# EAGLE design Grove - BLE v1.0 (EAGLE 6.4)

## Sheet 1 of 2
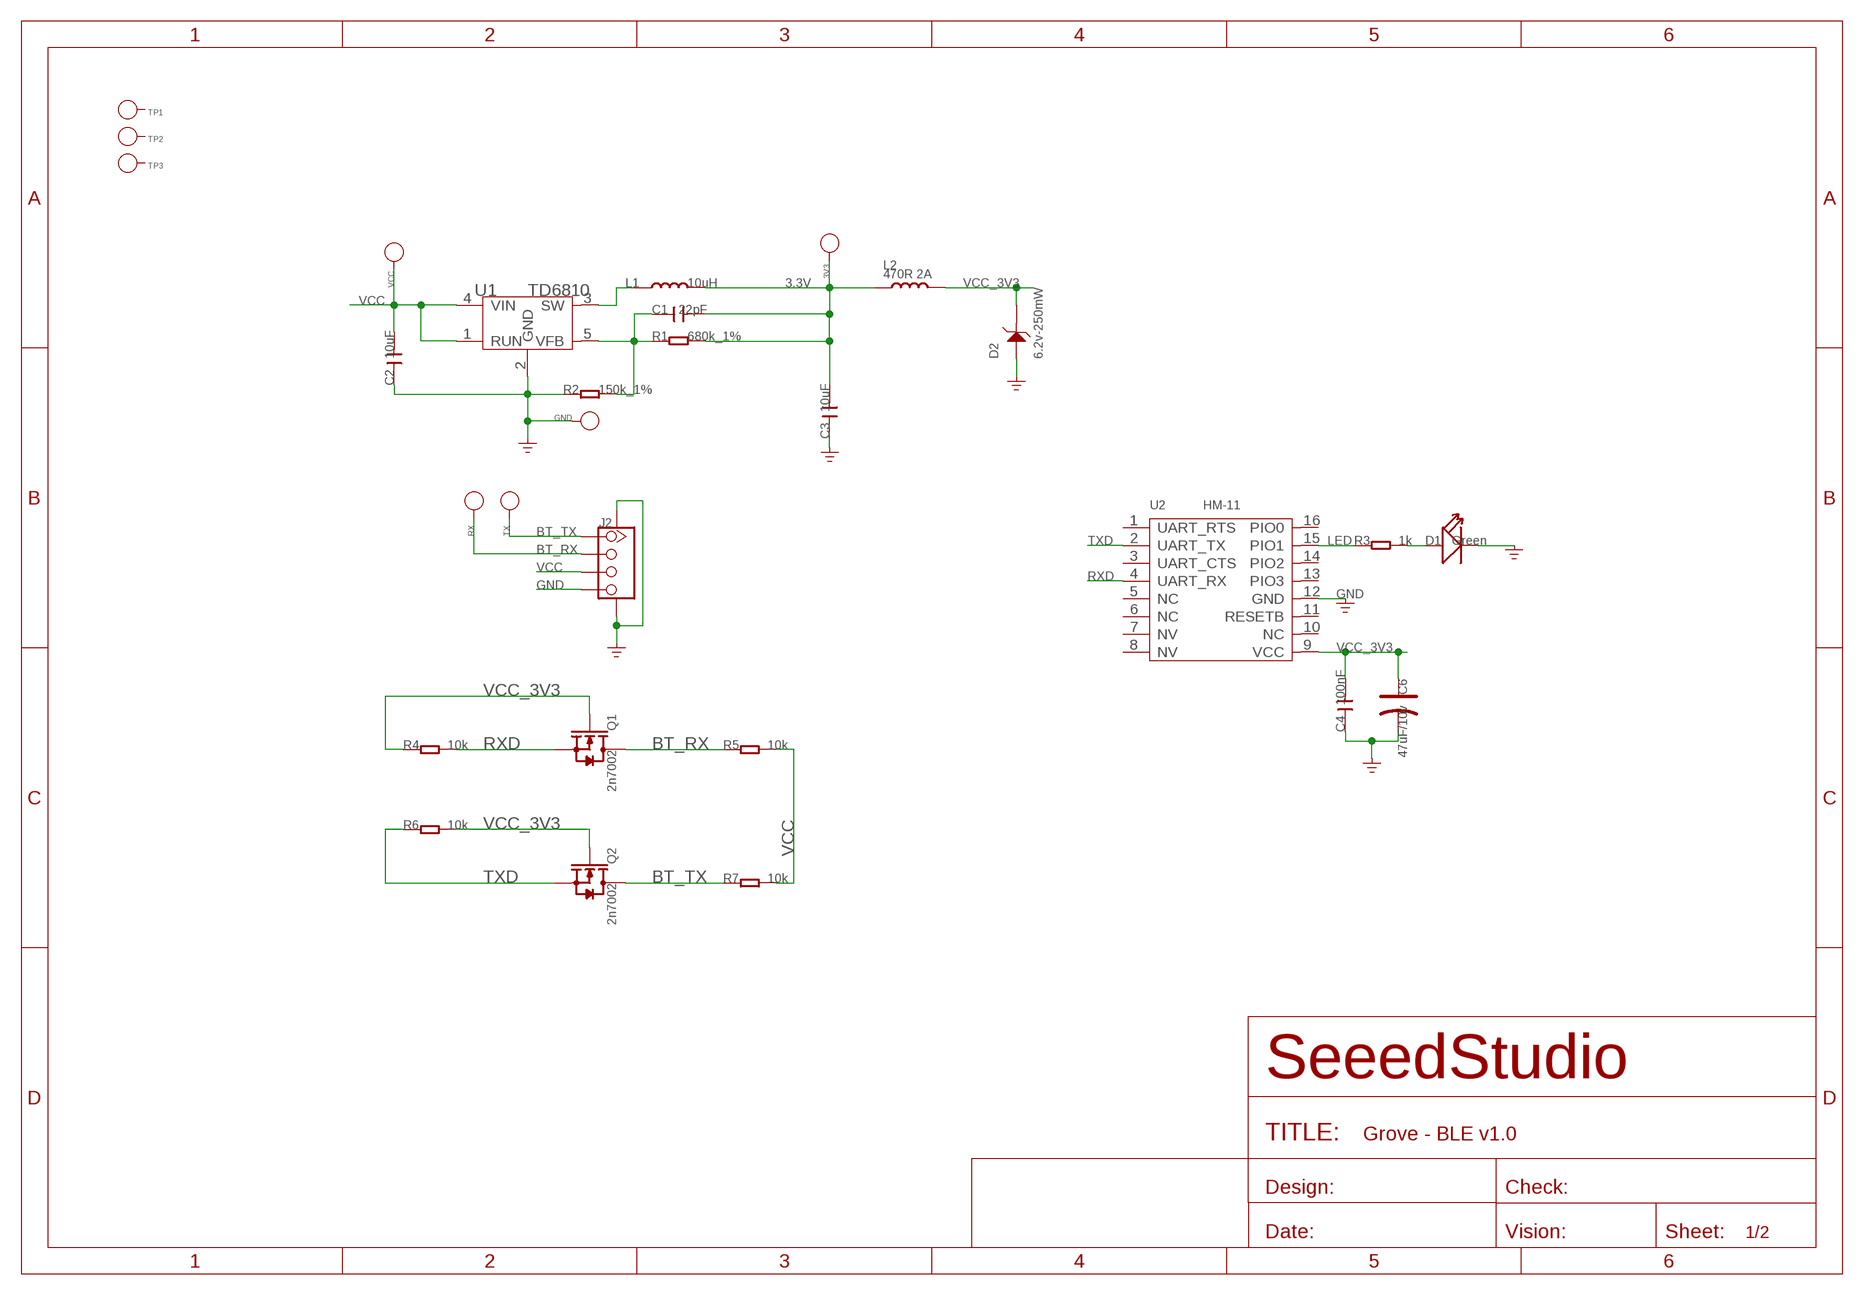
[diagram p0: schematic, sheet 1]

### Parts
3V3  PAD-TEST-POINT'4545'  [TP_4545]
C1  22pF  C-0603  [C0603]
C2  10uF  C-0805  [C0805]
C3  10uF  C-0805  [C0805]
C4  100nF  C-0603  [C0603]
C6  47uF/10v  CAP-AVX-B  [AVX-B]
D1  Green  LED'0603'  [LED-0603]
D2  6.2v-250mW  D-ESD-2P'CESD5V0D1'  [SOD123-2.7X1.6]
GND  PAD-TEST-POINT'4545'  [TP_4545]
J2  TWIG-4P-2.0-SMD-FEMALE-REINFORCE'DD'  [4P-SMD-2.0]
L1  10uH  L'1813'  [1813]
L2  470R 2A  L'0805'  [L0805]
Q1  2n7002  MOSFET-N'SOT23'  [SOT23]
Q2  2n7002  MOSFET-N'SOT23'  [SOT23]
R1  680k_1%  005-R0603  [0603@1]
R2  150k_1%  005-R0603  [0603@1]
R3  1k  R-0603  [R0603]
R4  10k  R-0603  [R0603]
R5  10k  R-0603  [R0603]
R6  10k  R-0603  [R0603]
R7  10k  R-0603  [R0603]
RX  PAD-TEST-POINT'4545'  [TP_4545]
TP1  PAD-TEST-POINT'4545'  [TP_4545]
TP2  PAD-TEST-POINT'4545'  [TP_4545]
TP3  PAD-TEST-POINT'4545'  [TP_4545]
TX  PAD-TEST-POINT'4545'  [TP_4545]
U1  TD6810  TD6810'TSOT23-5'  [SOT23-5]
U2  HM-11  [16P-18.5X13.5X0.8]
VCC  PAD-TEST-POINT'4545'  [TP_4545]

### Nets
3.3V: 3V3.T C1.2 C3.2 L1.2 L2.1 R1.2
BT_RX: J2.2 Q1.3(D) R5.1 RX.T
BT_TX: J2.1 Q2.3(D) R7.1 TX.T
GND: C2.1 C3.1 C4.1 C6.- D1.- D2.1 GND.T J2.4 J2.SS1 J2.SS2 R2.1 U1.2(GND) U2.12(GND)
LED: R3.1 U2.15(PIO1)
N$7: D1.+ R3.2
N$13: C1.1 R1.1 R2.2 U1.5(VFB)
N$18: L1.1 U1.3(SW)
RXD: Q1.2(S) R4.2 U2.4(UART_RX)
TXD: Q2.2(S) R6.1 U2.2(UART_TX)
VCC: C2.2 J2.3 R5.2 R7.2 U1.1(RUN) U1.4(VIN) VCC.T
VCC_3V3: C4.2 C6.+ D2.2 L2.2 Q1.1(G) Q2.1(G) R4.1 R6.2 U2.9(VCC)
Unconnected: TP1.T TP2.T TP3.T U2.1(UART_RTS) U2.3(UART_CTS) U2.5(NC) U2.6(NC) U2.7(NV) U2.8(NV) U2.10(NC) U2.11(RESETB) U2.13(PIO3) U2.14(PIO2) U2.16(PIO0)

## Sheet 2 of 2
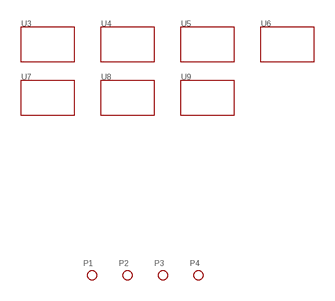
[diagram p1: schematic, sheet 2]

### Parts
P1  PAD-MARK  [ROUND-MARK-1.0]
P2  PAD-MARK  [ROUND-MARK-1.0]
P3  PAD-MARK  [ROUND-MARK-1.0]
P4  PAD-MARK  [ROUND-MARK-1.0]
U3  TWIG'2U'  [GROVE-TEST-PLATFORM]
U4  TWIG'2U'  [GROVE-TEST-PLATFORM]
U5  TWIG'2U'  [GROVE-TEST-PLATFORM]
U6  TWIG'2U'  [GROVE-TEST-PLATFORM]
U7  TWIG'2U'  [GROVE-TEST-PLATFORM]
U8  TWIG'2U'  [GROVE-TEST-PLATFORM]
U9  TWIG'2U'  [GROVE-TEST-PLATFORM]

## Library data of the parts
3V3 GND RX TP1-TP3 TX VCC = Discrete:PAD-TEST-POINT; PARTNO: DNP
C1-C4 = Discrete:C*: Ceramic Capacitors
C6 = Discrete:CAP*: Electrolytic Capacitors,Tantalum Capacitors and Super Capacitors
D1 = Discrete:LED*
D2 = Discrete:D-ESD-2P: Diodes for Protectiong against ESD
J2 = Connector :TWIG-4P-2.0-SMD-FEMALE-REINFORCE
L1 L2 = Discrete:L*
P1-P4 = Discrete:PAD-MARK; PARTNO: DNP
Q1 Q2 = Discrete:MOSFET-N: IRLL014: http://www.vishay.com/docs/91319/sihll014.pdf
R1 R2 = Discrete:005-R*
R3-R7 = Discrete:R*
U1 = IC:TD6810: 1.5MHz 800mA Synchronous Step-Down Regulator Dropout http://www.techcodeok.com/download/TD6810.pdf
U2 = template:HM-11: Bluetooth Specification V4.0 BLE
U3-U9 = template:TWIG

## Net classes
0 default: width 0.152 mm, drill 0.305 mm, clearance 0.152 mm

## Board
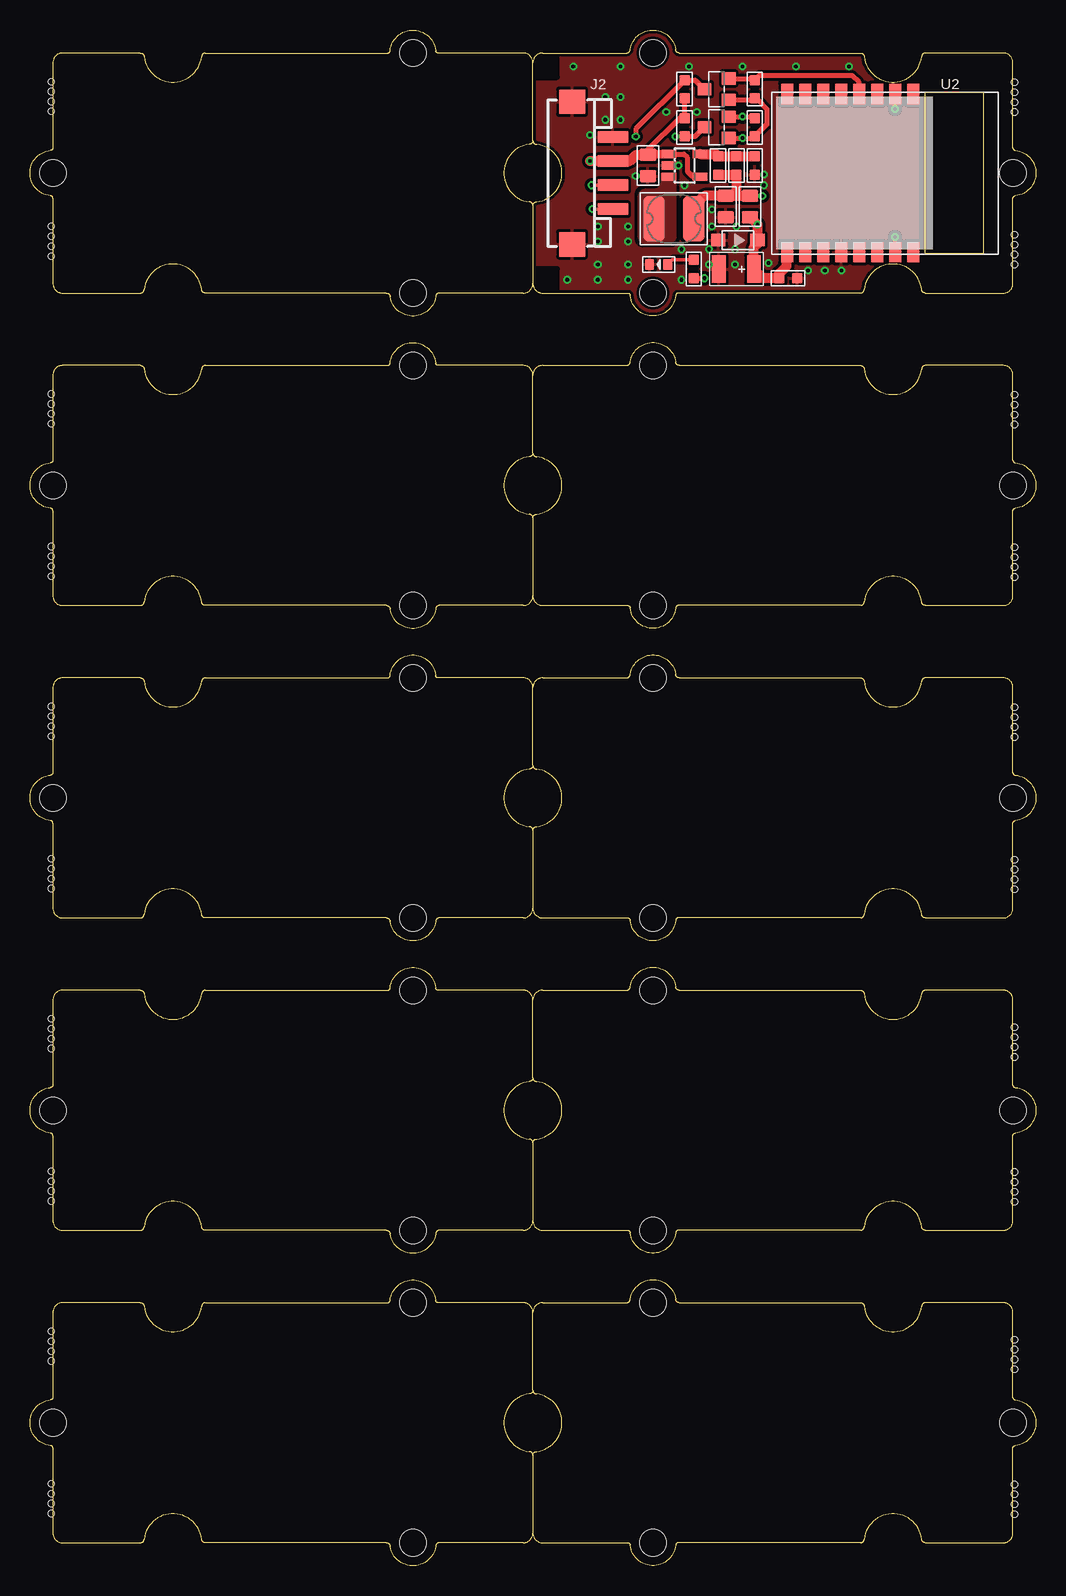
[diagram p2: board, top side]
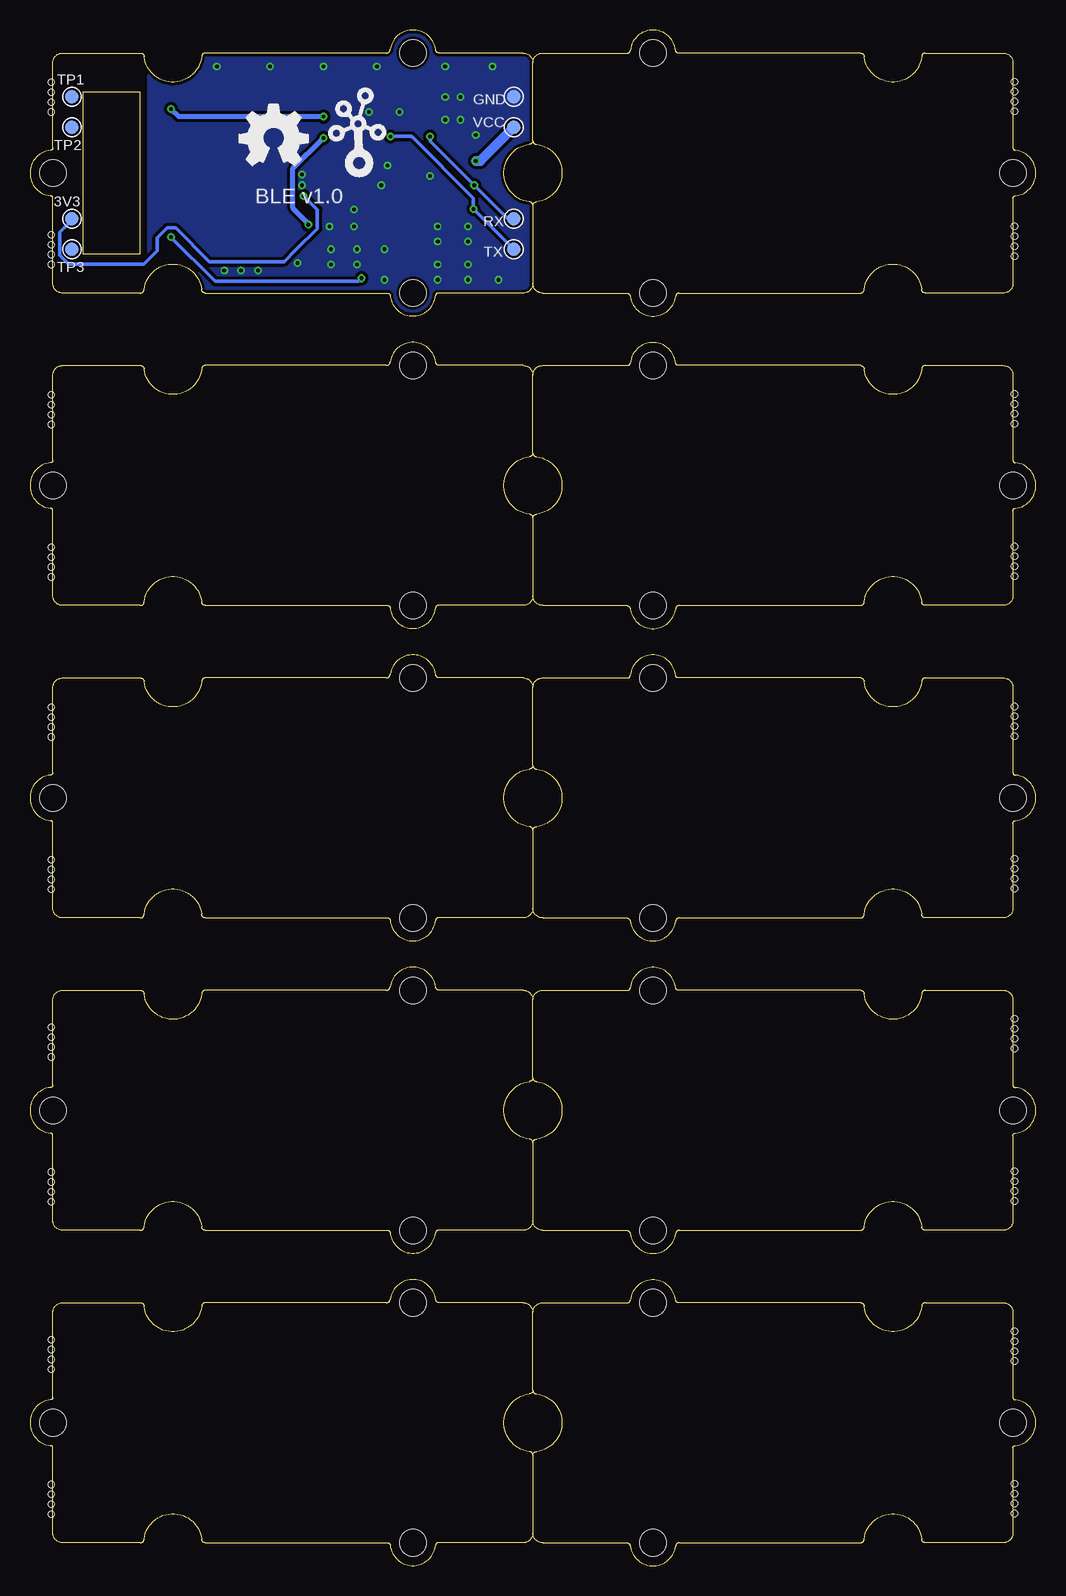
[diagram p3: board, bottom side, seen from below]

Size 83.82 x 127.98 mm. Coordinates in mm from the lower left corner, seen from the top.
Outline: 74.61,122.79 79.44,122.79 79.44,109.33 74.61,109.33 74.61,122.79
Copper layers (1*16): Top 0.035mm / dielectric 1.5mm / Bottom 0.035mm
Design rules "SeeedStudio_DRU_no_angle_20130527 *": minimum track width 6mil, minimum drill 12mil, track to track 6mil, track to pad 6mil, pad to pad 6mil, via to via 6mil, smd to smd 0mil, copper to edge 10mil, drill to drill 10mil, minimum pad ring 10mil, minimum via ring 6mil, stop-mask expansion 2mil, vias tented up to drill 25mil, thermal gap 10mil
Holes 0.5 mm at 1.78,32.88 1.78,30.4 1.78,31.23 1.78,32.05 1.78,45.58 1.78,43.1 1.78,43.93 1.78,44.75 1.78,58.91 1.78,56.43 1.78,57.26 1.78,58.09 1.78,71.61 1.78,69.13 1.78,69.96 1.78,70.79 1.78,84.95 1.78,82.47 1.78,83.3 1.78,84.12 1.78,97.65 1.78,95.17 1.78,96 1.78,96.82 1.78,111.62 1.78,109.14 1.78,109.97 1.78,110.79 1.78,123.68 1.78,121.2 1.78,122.03 1.78,122.86 82.04,121.14 82.04,123.62 82.04,122.79 82.04,121.97 82.04,108.44 82.04,110.92 82.04,110.09 82.04,109.27 82.04,95.11 82.04,97.58 82.04,96.76 82.04,95.93 82.04,82.41 82.04,84.88 82.04,84.06 82.04,83.23 82.04,69.07 82.04,71.55 82.04,70.72 82.04,69.9 82.04,56.37 82.04,58.85 82.04,58.02 82.04,57.2 82.04,42.4 82.04,44.88 82.04,44.05 82.04,43.23 82.04,30.34 82.04,32.81 82.04,31.99 82.04,31.16 1.78,6.84 1.78,4.36 1.78,5.19 1.78,6.02 1.78,19.54 1.78,17.06 1.78,17.89 1.78,18.72 82.04,16.37 82.04,18.84 82.04,18.02 82.04,17.19 82.04,4.3 82.04,6.78 82.04,5.95 82.04,5.13
Holes 1.91 mm at -4.13,2.4 87.95,2.4 87.95,125.59 -4.13,125.59

### Footprints (pad centres in the part's own frame; a part is rotated, then mirrored left to right if it is on the bottom)
TP_4545 = smd 1.143 x 1.143: T 0,0
C0603 = smd 0.889 x 0.889: 1 -0.762,0; 2 0.762,0
C0805 = smd 1.016 x 1.397: 1 -0.889,0; 2 0.889,0
AVX-B = smd 1.143 x 2.286: + -1.46,0; - 1.46,0
LED-0603 = smd 0.762 x 0.889: + -0.762,0; - 0.762,0
SOD123-2.7X1.6 = smd 1.2 x 1.02: 1 -1.635,0; 2 1.635,0
4P-SMD-2.0 = smd 0.965 x 2.54: 1 -3,0; 2 -1,0; 3 1,0; 4 3,0 | smd 2.032 x 2.184: SS1 -5.946,3.4; SS2 5.946,3.4
1813 = smd 1.778 x 3.81: 1 -1.651,0; 2 1.651,0
L0805 = smd 1.016 x 1.397: 1 -0.889,0; 2 0.889,0
ROUND-MARK-1.0 = smd 1.016 x 1.016: P$1 0,0
SOT23 = smd 1.016 x 1.143: 1 -0.889,-1.016; 2 0.889,-1.016; 3 0,1.016
0603@1 = smd 0.889 x 0.889: 1 -0.762,0; 2 0.762,0
R0603 = smd 0.889 x 0.889: 1 -0.762,0; 2 0.762,0
SOT23-5 = smd 0.69 x 1.2: 1 -0.95,-1.3; 2 0,-1.3; 3 0.95,-1.3; 4 0.95,1.3; 5 -0.95,1.3
16P-18.5X13.5X0.8 = smd 1.7 x 1: 1 -6.6,2.15; 2 -6.6,0.65; 3 -6.6,-0.85; 4 -6.6,-2.35; 5 -6.6,-3.85; 6 -6.6,-5.35; 7 -6.6,-6.85; 8 -6.6,-8.35; 9 6.6,-8.35; 10 6.6,-6.85; 11 6.6,-5.35; 12 6.6,-3.85; 13 6.6,-2.35; 14 6.6,-0.85; 15 6.6,0.65; 16 6.6,2.15
GROVE-TEST-PLATFORM = hole 2.2: -10,-10; -10,10; 20,0
GROVE-2CONNECTOR = hole 2.2: -10,-10; -10,10; 20,0

### Placement (x,y rotation side)
3V3  80.33,112.25 0 bottom
C1  57.34,116.7 270 top
C2  51.5,116.7 90 top
C3  57.98,113.27 90 top
C4  63.18,107.3 180 top
C6  58.87,108.06 180 top
D1  52.39,108.44 180 top
D2  58.99,110.47 0 top
GND  43.5,122.41 0 bottom
J2  48.58,116.06 90 top
L1  53.66,112.25 0 top
L2  60.01,113.27 270 top
P1  -4.13,7.48 0 top  (outside the outline)
P2  87.95,7.48 0 top  (outside the outline)
P3  -4.13,120.51 0 top  (outside the outline)
P4  87.95,120.51 0 top  (outside the outline)
Q1  57.21,123.05 90 top
Q2  57.21,119.87 90 top
R1  58.87,116.7 270 top
R2  60.39,116.7 90 top
R3  55.31,108.06 90 top
R4  60.39,123.05 90 top
R5  54.55,123.05 270 top
R6  60.39,119.87 270 top
R7  54.55,119.87 90 top
RX  43.5,112.25 0 bottom
TP1  80.33,122.41 0 bottom
TP2  80.33,119.87 0 bottom
TP3  80.33,109.71 0 bottom
TX  43.5,109.71 0 bottom
U1  54.55,116.7 270 top
U2  71.44,116.06 270 top
U3  61.91,37.96 0 top
U4  21.91,37.96 180 top
U5  61.91,63.99 0 top
U6  21.91,63.99 180 top
U7  61.91,90.03 0 top
U8  21.91,90.03 180 top
U9  21.91,116.06 180 top
U11  [GROVE-TEST-PLATFORM]  61.91,11.92 0 top
U12  [GROVE-TEST-PLATFORM]  21.91,11.92 180 top
U$6  [GROVE-2CONNECTOR]  61.91,116.06 0 top
U$8  [OSHW_FILLX200_NOTEXT]  66.36,116.7 0 bottom
U$9  [TWIGLOGO]  56.45,116.7 0 bottom
VCC  43.5,119.87 0 bottom

### Tracks (layer width: path | path; a pad name or v marks a point on that pad's centre or on a via)
3.3V  (via drill 0.3 pad 0.64)
  Top 0.305: v61.02,114.16 59.88,114.16
  Top 0.813: C1.2 R1.2 58.87,114.16 | 58.87,114.16 C3.2 56.2,114.16 55.31,113.27 L1.2 | 58.87,114.16 59.88,114.16 L2.1 60.26,114.16
  Bottom 0.305: 3V3.T 80.33,112.12 81.34,111.11 81.34,109.2 80.58,108.44 74.35,108.44 73.22,109.58 73.22,110.68 72.4,111.49 71.69,111.49 68.89,108.68 62.63,108.68 61.66,109.66 59.88,111.43 59.88,113.01 60.26,113.39 v61.02,114.16
BT_RX  (via drill 0.3 pad 0.64)
  Top 0.305: v46.8,115.05 48.56,115.05 J2.2
  Top 0.406: Q1.3 55.44,123.81 R5.1 50.48,119.74 v50.48,119.11
  Bottom 0.305: RX.T 44.01,112.25 v46.8,115.05 50.48,118.73 v50.48,119.11
BT_TX  (via drill 0.3 pad 0.64)
  Top 0.305: J2.1 46.88,113.06 v46.86,113.08 | v53.79,119.11 R7.1
  Top 0.406: R7.1 55.44,119.11 Q2.3
  Bottom 0.305: TX.T v46.86,113.08 46.86,113.97 51.97,119.07 arc-45 52.06,119.11 v53.79,119.11
GND  (via drill 0.3 pad 0.64)
  other vias: 47.94,120.51 49.21,120.51 46.67,119.24 61.15,115.93 54.04,116.7 49.85,110.35 50.48,115.81 49.85,111.62 49.85,107.17 54.29,109.71 56.58,108.44 56.58,109.71 56.83,111.62 56.83,113.01 54.55,115.05 61.15,115.05 58.74,108.44 58.74,109.71 58.87,111.62 64.83,107.93 67.63,107.93 66.23,107.93 47.31,110.35 47.31,107.17 44.77,107.17 47.94,122.41 49.21,124.95 45.28,124.95 54.93,124.95 59.37,124.95 63.82,124.95 68.26,124.95 54.29,107.17 47.31,111.62 61.53,108.57 49.21,122.41 53.02,121.14 55.56,121.14 49.85,108.44 47.31,108.44
  pour Bottom (isolate 0.254): 41.59,128.13 73.98,128.13 73.98,105.27 73.98,104 41.59,104
  pour Top (isolate 0.254, rank 6): 41.59,128.13 73.98,128.13 73.98,105.27 73.98,104 41.59,104
LED  (via drill 0.3 pad 0.64)
  Top 0.305: v72.07,110.73 72.07,109.48 U2.15
  Top 0.406: R3.1 v56.2,107.3
  Bottom 0.305: v72.07,110.73 68.39,107.04 56.45,107.04 v56.2,107.3
N$7
  Top 0.305: R3.2 53.53,108.82 D1.+
N$13
  Top 0.813: U1.5 57.15,117.65 C1.1 R1.1 R2.2
N$18
  pour Top (isolate 0.254, no thermals): 52.64,115.3 52.64,115.93 arc-90 52.77,116.06 53.79,116.06 53.79,110.85 arc-90 53.15,110.22 51.37,110.22 arc-90 50.74,110.85 50.74,114.03 arc-90 51.37,114.66 52.01,114.66 arc90
RXD
  Top 0.406: Q1.2 60.26,123.94 R4.2 60.77,124.19 68.52,124.19 69.09,123.62 U2.4
TXD  (via drill 0.3 pad 0.64)
  Top 0.406: Q2.2 v59.37,120.76 60.26,120.76 R6.1 | v72.07,121.4 72.07,122.65 U2.2
  Bottom 0.406: v59.37,120.76 71.44,120.76 v72.07,121.4
VCC  (via drill 0.3 pad 0.64)
  Top 0.406: U1.4 55.24,115.75 54.8,116.19 54.8,117.33 54.49,117.65 U1.1 | C2.2 51.5,117.99 54.14,120.63 R7.2 R5.2
  Top 0.711: U1.1 51.5,117.65 C2.2
  Top 0.813: C2.2 50.48,117.59 49.96,117.06 J2.3 46.69,117.06 v46.67,117.08
  Bottom 0.813: v46.67,117.08 46.29,117.08 VCC.T
VCC_3V3  (via drill 0.3 pad 0.64)
  Top 0.406: Q2.1 v59.37,118.98 60.26,118.98 R6.2 61.41,120.13 61.41,121.4 60.64,122.16 60.26,122.16 | Q1.1 60.26,122.16 | 60.26,122.16 R4.1
  Top 0.813: L2.2 v60.63,111.76 D2.2 60.63,110.2 60.33,109.9 C6.+ 61.09,107.3 C4.2 62.42,107.68 63.06,108.31 63.06,109.43 U2.9
  Bottom 0.406: v60.63,111.76 60.63,111.85 61.91,113.14 61.91,116.44 v59.37,118.98

### Text on the board
bPlace: BLE v1.0